# EAGLE schematic SendSlice (EAGLE 7.5.0)
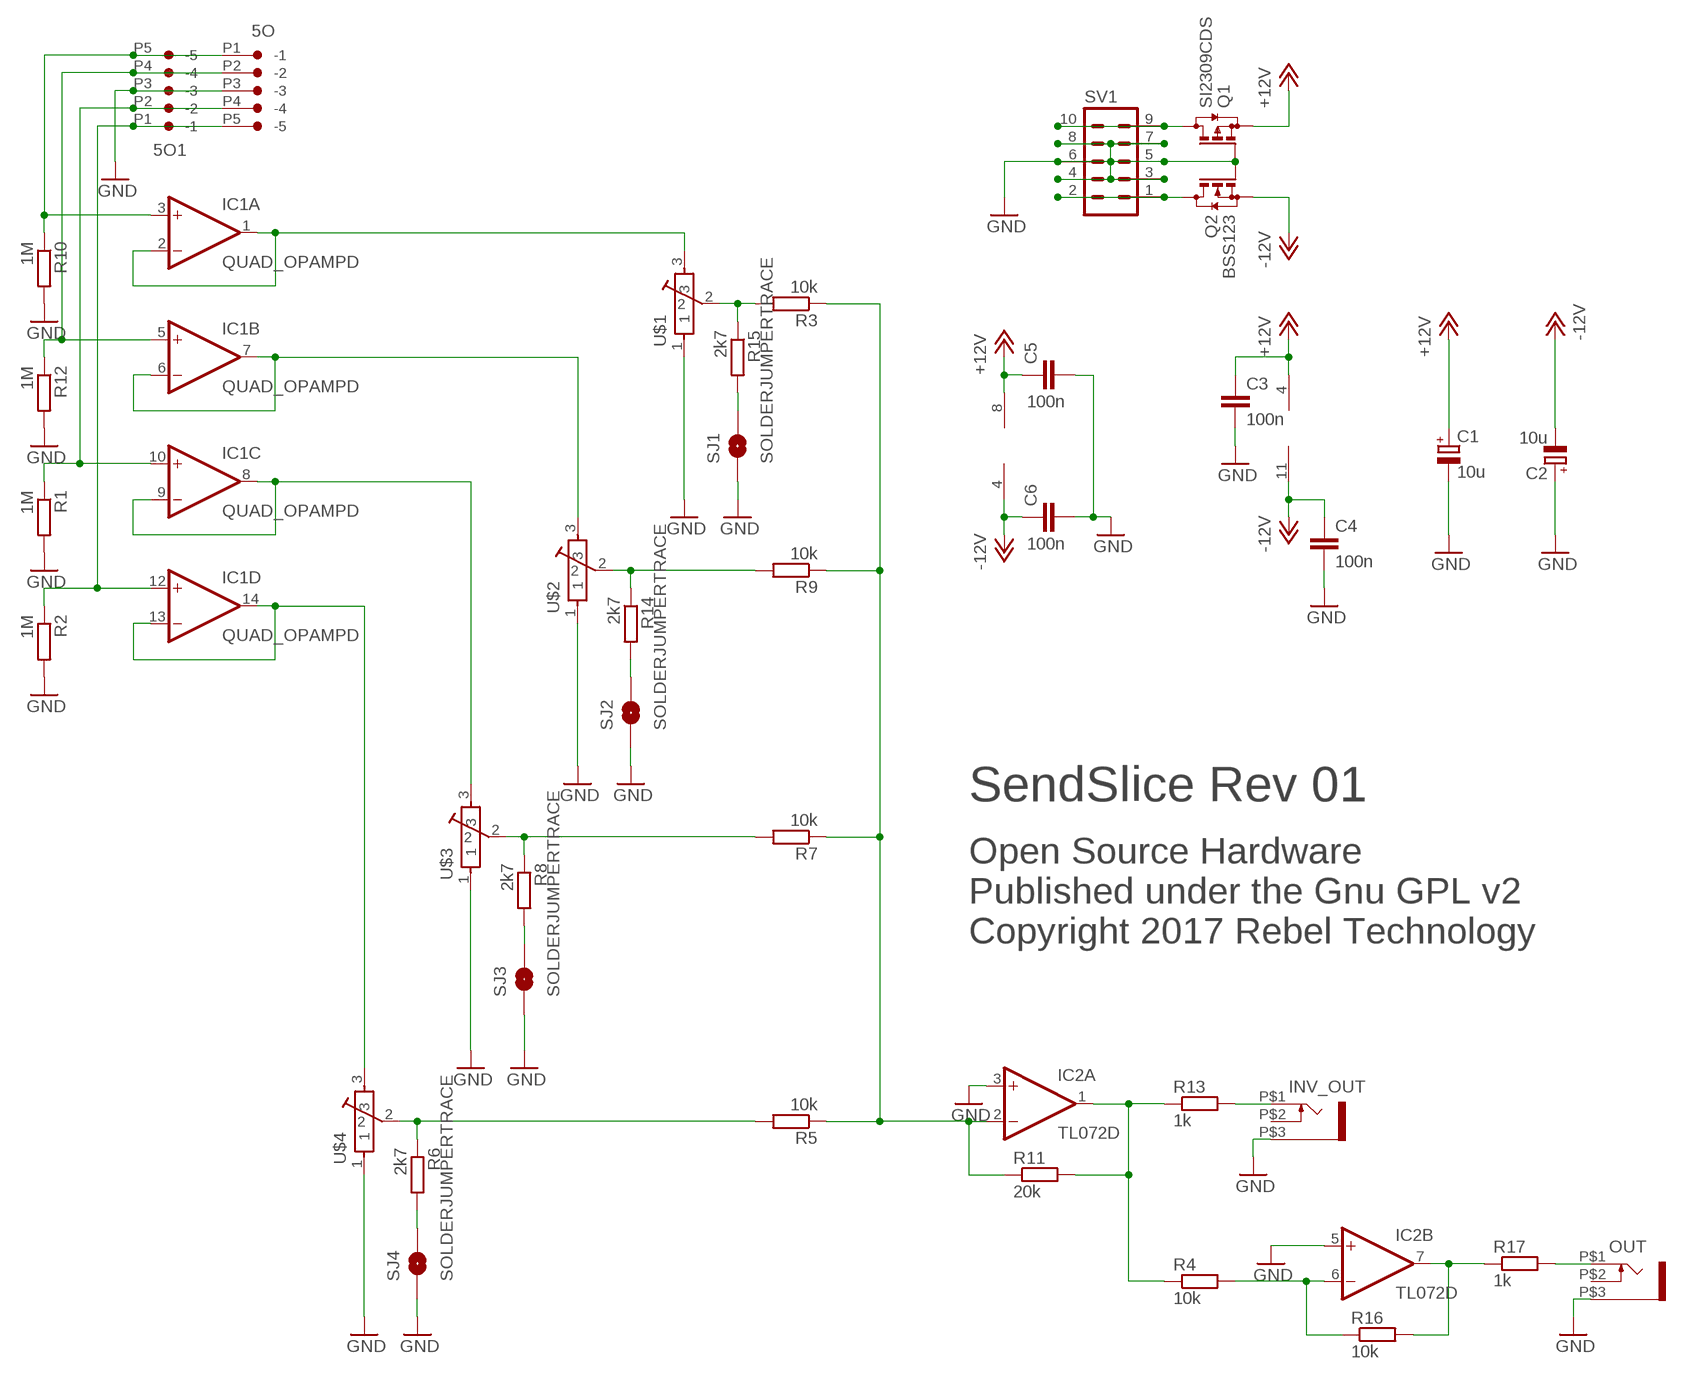
[diagram p0: schematic, sheet 1]

## Parts
5O  CON-JST_PH_5W  [CON-JST_PH_5W]
5O1  CON-JST_PH_5W  [CON-JST_PH_5W]
C1  10u  CPOL-EU153CLV-0505  [153CLV-0505]
C2  10u  CPOL-EU153CLV-0505  [153CLV-0505]
C3  100n  C-EUC0603  [C0603]
C4  100n  C-EUC0603  [C0603]
C5  100n  C-EUC0603  [C0603]
C6  100n  C-EUC0603  [C0603]
IC1  QUAD_OPAMPD  [SO14]
IC2  TL072D  [SO08]
INV_OUT  JACK-UJ-3502-R  [UJ-3502-R]
OUT  JACK-UJ-3502-R  [UJ-3502-R]
Q1  SI2309CDS  BSS84  [SOT23]
Q2  BSS123  [SOT23]
R1  1M  R-EU_0603  [0603]
R2  1M  R-EU_0603  [0603]
R3  10k  R-EU_0603  [0603]
R4  10k  R-EU_0603  [0603]
R5  10k  R-EU_0603  [0603]
R6  2k7  R-EU_0603  [0603]
R7  10k  R-EU_0603  [0603]
R8  2k7  R-EU_0603  [0603]
R9  10k  R-EU_0603  [0603]
R10  1M  R-EU_0603  [0603]
R11  20k  R-EU_0603  [0603]
R12  1M  R-EU_0603  [0603]
R13  1k  R-EU_0603  [0603]
R14  2k7  R-EU_0603  [0603]
R15  2k7  R-EU_0603  [0603]
R16  10k  R-EU_0603  [0603]
R17  1k  R-EU_0603  [0603]
SJ1  SOLDERJUMPERTRACE  [SJ_2S-TRACE]
SJ2  SOLDERJUMPERTRACE  [SJ_2S-TRACE]
SJ3  SOLDERJUMPERTRACE  [SJ_2S-TRACE]
SJ4  SOLDERJUMPERTRACE  [SJ_2S-TRACE]
SV1  MA05-2  [MA05-2]
U$1  10k lin  POT-BOURNS-PTD901  [POT-BOURNS-PTD901]
U$2  10k lin  POT-BOURNS-PTD901  [POT-BOURNS-PTD901]
U$3  10k lin  POT-BOURNS-PTD901  [POT-BOURNS-PTD901]
U$4  10k lin  POT-BOURNS-PTD901  [POT-BOURNS-PTD901]

## Nets
+12V: C1.+ C3.1 C5.1 IC1.4(P:V+) IC2.8(P:V+) Q1.2(S)
-12V: C2.- C4.1 C6.1 IC1.11(P:V-) IC2.4(P:V-) Q2.2(S)
GND: 5O1.P3(-3) 5O.P3(-3) C1.- C2.+ C3.2 C4.2 C5.2 C6.2 IC2.3(A:+IN) IC2.5(B:+IN) INV_OUT.P$3(SLEEVE) OUT.P$3(SLEEVE) Q1.1(G) Q2.1(G) R1.2 R2.2 R10.2 R12.2 SJ1.1 SJ2.1 SJ3.1 SJ4.1 SV1.3 SV1.4 SV1.5 SV1.6 SV1.7 SV1.8 U$1.1 U$2.1 U$3.1 U$4.1
IN_1: 5O1.P1(-1) 5O.P5(-5) IC1.12(D:+IN) R2.1
IN_2: 5O1.P2(-2) 5O.P4(-4) IC1.10(C:+IN) R1.1
IN_3: 5O1.P4(-4) 5O.P2(-2) IC1.5(B:+IN) R12.1
IN_4: 5O1.P5(-5) 5O.P1(-1) IC1.3(A:+IN) R10.1
N$1: Q2.3(D) SV1.1 SV1.2
N$2: R9.2 R14.1 U$2.2
N$3: R3.2 R15.1 U$1.2
N$4: IC1.6(B:-IN) IC1.7(B:OUT) U$2.3
N$5: IC1.1(A:OUT) IC1.2(A:-IN) U$1.3
N$6: IC2.1(A:OUT) R4.1 R11.2 R13.1
N$7: IC2.7(B:OUT) R16.2 R17.1
N$8: IC2.2(A:-IN) R3.1 R5.1 R7.1 R9.1 R11.1
N$9: INV_OUT.P$1(TIP) R13.2
N$10: R15.2 SJ1.2
N$11: IC1.13(D:-IN) IC1.14(D:OUT) U$4.3
N$12: R6.2 SJ4.2
N$13: IC1.8(C:OUT) IC1.9(C:-IN) U$3.3
N$14: Q1.3(D) SV1.9 SV1.10
N$15: R8.2 SJ3.2
N$16: R14.2 SJ2.2
N$17: IC2.6(B:-IN) R4.2 R16.1
N$18: OUT.P$1(TIP) R17.2
N$29: R5.2 R6.1 U$4.2
N$51: R7.2 R8.1 U$3.2
Unconnected: INV_OUT.P$2(SW) OUT.P$2(SW)

## Notes on the sheet
- SendSlice Rev 01
- Open Source Hardware
  Published under the Gnu GPL v2
  Copyright 2017 Rebel Technology

## Library data of the parts
5O 5O1 = Rebel:CON-JST_PH_5W
C1 C2 = rcl:CPOL-EU: POLARIZED CAPACITOR, European symbol
C3-C6 = Rebel:C-EU: CAPACITOR, European symbol
IC1 = adafruit:QUAD_OPAMP: OP AMP Standard quad package
IC2 = linear:TL072: OP AMP
INV_OUT OUT = Rebel:JACK-UJ-3502-R
Q1 = transistor-small-signal:BSS84: P-CHANNEL MOS FET
Q2 = transistor-small-signal:BSS123: N-CHANNEL MOS FET
R1-R17 = Rebel:R-EU_: RESISTOR, European symbol
SJ1-SJ4 = SparkFun:SOLDERJUMPER: Solder Jumper Standard SMD solder jumper. Used to automate production. Two varients : Normally Open and Normally Closed are the same, but have different paste layers. NC will have a large amount of paste and should jumper during reflow.
SV1 = con-lstb:MA05-2: PIN HEADER; OC_FARNELL: unknown; OC_NEWARK: unknown
U$1-U$4 = Rebel:POT-BOURNS-PTD901